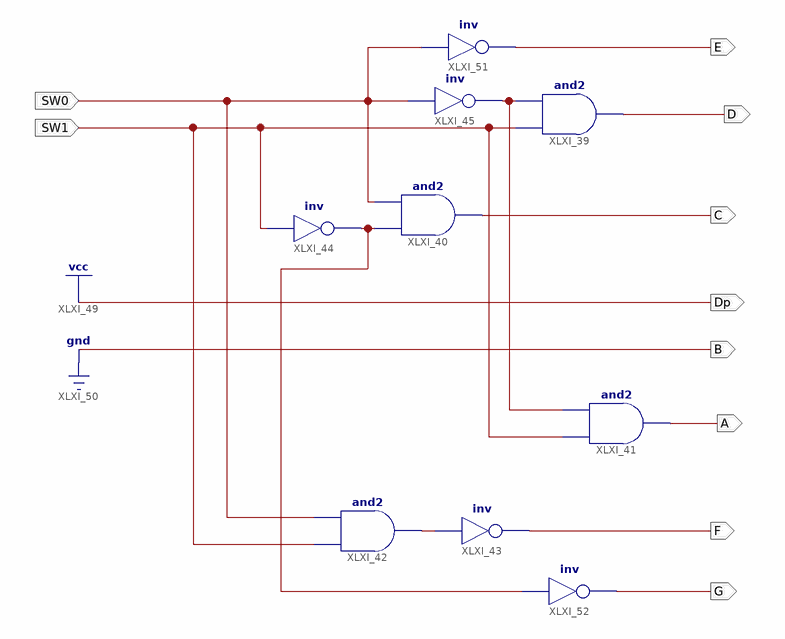
[diagram p0: schematic sheet 1]
// Xilinx ISE schematic SW_7SEG.sch (spartan6) as structural Verilog: 9 symbols, 10 ports
module SW_7SEG (
  input  SW0,
  input  SW1,
  output Dp,
  output D,
  output E,
  output A,
  output B,
  output C,
  output F,
  output G
);

  wire XLXN_50, XLXN_51, XLXN_73;

  and XLXI_39 (D, SW1, XLXN_73);
  and XLXI_40 (C, XLXN_51, SW0);
  and XLXI_41 (A, SW1, XLXN_73);
  and XLXI_42 (XLXN_50, SW1, SW0);
  not XLXI_43 (F, XLXN_50);
  not XLXI_44 (XLXN_51, SW1);
  not XLXI_45 (XLXN_73, SW0);
  not XLXI_51 (E, SW0);
  not XLXI_52 (G, XLXN_51);

  assign B = 1'b0;
  assign Dp = 1'b1;
endmodule
